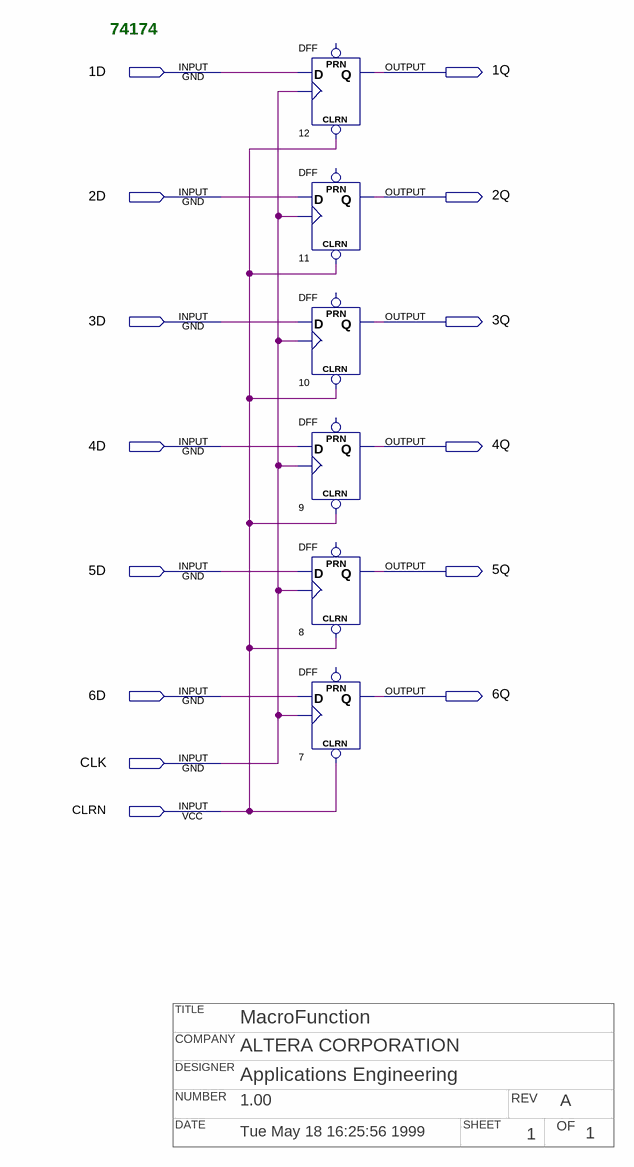
[diagram p0: schematic sheet]
// Quartus schematic 74174.bdf as structural Verilog: 6 symbols, 14 pins
// Title block: TITLE: MacroFunction; COMPANY: ALTERA CORPORATION; DESIGNER: Applications Engineering; NUMBER: 1.00; REV: A; DATE: Tue May 18 16:25:56 1999; SHEET: 1; OF: 1
module \74174  (
  input  \1D ,
  input  \2D ,
  input  \3D ,
  input  \4D ,
  input  \5D ,
  input  \6D ,
  input  CLK,
  input  CLRN,
  output \1Q ,
  output \2Q ,
  output \3Q ,
  output \4Q ,
  output \5Q ,
  output \6Q 
);

  DFF u_12 (.CLRN(CLRN), .CLK(CLK), .D(\1D ), .Q(\1Q ));  // open: PRN
  DFF u_11 (.CLRN(CLRN), .CLK(CLK), .D(\2D ), .Q(\2Q ));  // open: PRN
  DFF u_10 (.CLRN(CLRN), .CLK(CLK), .D(\3D ), .Q(\3Q ));  // open: PRN
  DFF u_9 (.CLRN(CLRN), .CLK(CLK), .D(\4D ), .Q(\4Q ));  // open: PRN
  DFF u_8 (.CLRN(CLRN), .CLK(CLK), .D(\5D ), .Q(\5Q ));  // open: PRN
  DFF u_7 (.CLRN(CLRN), .CLK(CLK), .D(\6D ), .Q(\6Q ));  // open: PRN

  // Notes on the sheet:
  //   74174
endmodule
